# EAGLE design Decoder_35 (EAGLE 9.0.0)
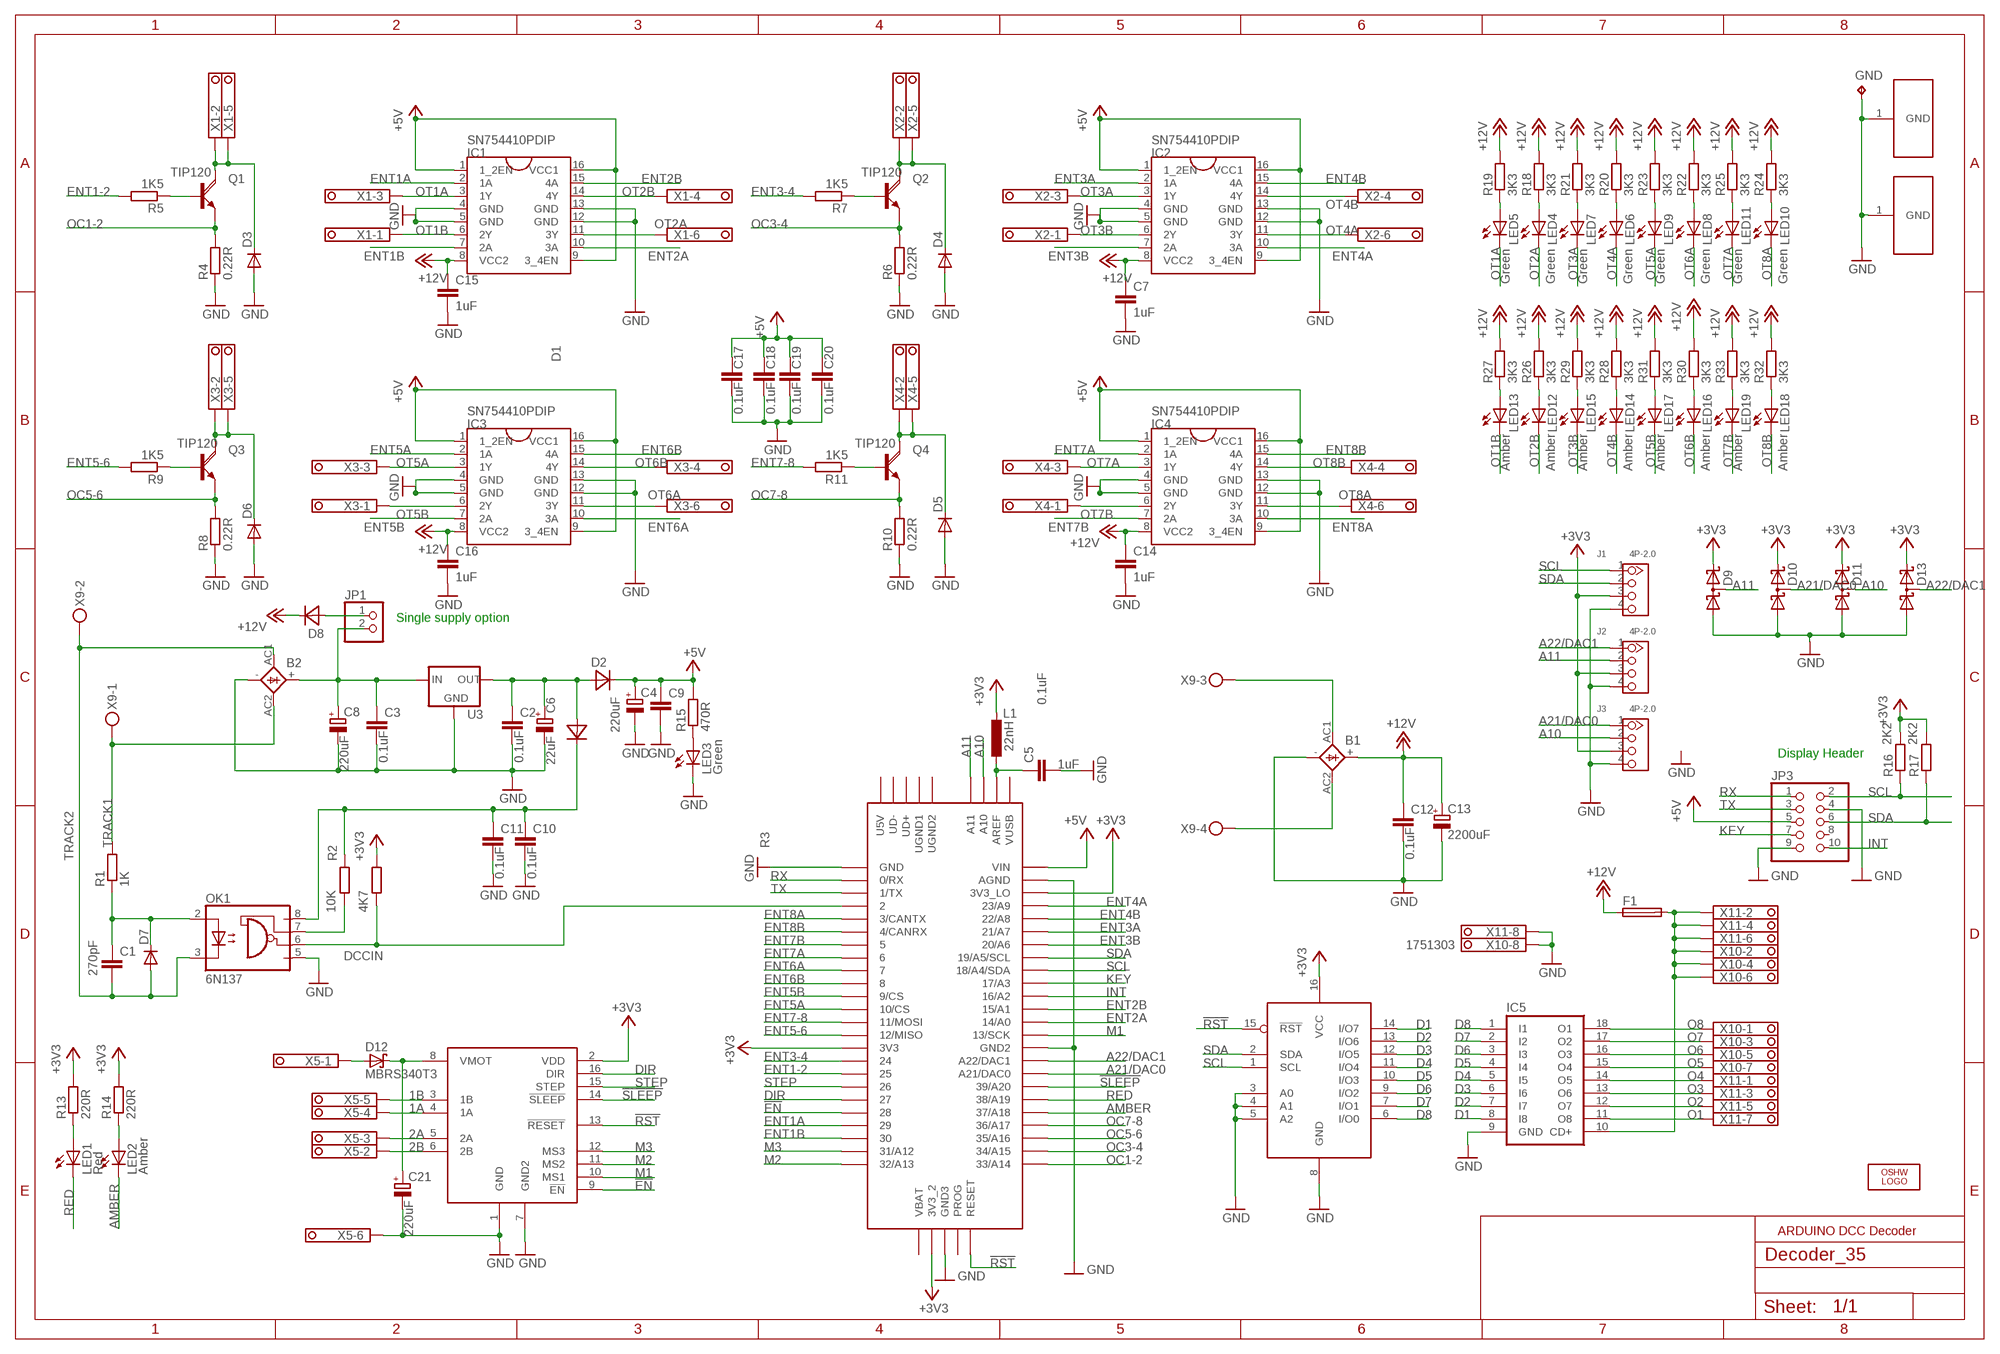
[diagram p0: schematic, sheet 1]

## Parts
B1  FB15A  [FB15A]
B2  FB15A  [FB15A]
C1  270pF  C-EUC0805  [C0805]
C2  0.1uF  C-EUC0805  [C0805]
C3  0.1uF  C-EUC0805  [C0805]
C4  220uF  CPOL-EUE2.5-5  [E2,5-5]
C5  1uF  C-EUC0805  [C0805]
C6  22uF  CPOL-EUE2.5-5  [E2,5-5]
C7  1uF  C-EUC0805  [C0805]
C8  220uF  CPOL-EUE5-8.5  [E5-8,5]
C9  0.1uF  C-EUC0805  [C0805]
C10  0.1uF  C-EUC0805  [C0805]
C11  0.1uF  C-EUC0805  [C0805]
C12  0.1uF  C-EUC0805  [C0805]
C13  2200uF  CPOL-EUE5-13  [E5-13]
C14  1uF  C-EUC0805  [C0805]
C15  1uF  C-EUC0805  [C0805]
C16  1uF  C-EUC0805  [C0805]
C17  0.1uF  C-EUC0805  [C0805]
C18  0.1uF  C-EUC0805  [C0805]
C19  0.1uF  C-EUC0805  [C0805]
C20  0.1uF  C-EUC0805  [C0805]
C21  220uF  CPOL-EUE5-8.5  [E5-8,5]
D1  MBRA340T3  [SMA]
D2  MBRA340T3  [SMA]
D3  CGRM4002-G  [SOD-123_MINI-SMA]
D4  CGRM4002-G  [SOD-123_MINI-SMA]
D5  CGRM4002-G  [SOD-123_MINI-SMA]
D6  CGRM4002-G  [SOD-123_MINI-SMA]
D7  CGRM4002-G  [SOD-123_MINI-SMA]
D8  MBRA340T3  [SMA]
D9  BAS70-04  [SOT23]
D10  BAS70-04  [SOT23]
D11  BAS70-04  [SOT23]
D12  MBRS340T3  [SMC]
D13  BAS70-04  [SOT23]
F1  SMD_FUSE  [1812]
GND  TPB2,54  [B2,54]
IC1  SN754410PDIP  [DIL16]
IC2  SN754410PDIP  [DIL16]
IC3  SN754410PDIP  [DIL16]
IC4  SN754410PDIP  [DIL16]
IC5  ULN2803A  [DIL18]
J1  4P-2.0  GROVE-CONNECTOR-DIP(4P-2.0)  [HW4-2.0]
J2  4P-2.0  GROVE-CONNECTOR-DIP(4P-2.0)  [HW4-2.0]
J3  4P-2.0  GROVE-CONNECTOR-DIP(4P-2.0)  [HW4-2.0]
JP1  PINHD-1X2  [1X02]
JP3  PINHD-2X5  [2X05]
L1  22nH  L-EUL2012C  [L2012C]
LED1  Red  LED3MM  [LED3MM]
LED2  Amber  LED3MM  [LED3MM]
LED3  Green  LED3MM  [LED3MM]
LED4  Green  LED3MM  [LED3MM]
LED5  Green  LED3MM  [LED3MM]
LED6  Green  LED3MM  [LED3MM]
LED7  Green  LED3MM  [LED3MM]
LED8  Green  LED3MM  [LED3MM]
LED9  Green  LED3MM  [LED3MM]
LED10  Green  LED3MM  [LED3MM]
LED11  Green  LED3MM  [LED3MM]
LED12  Amber  LED3MM  [LED3MM]
LED13  Amber  LED3MM  [LED3MM]
LED14  Amber  LED3MM  [LED3MM]
LED15  Amber  LED3MM  [LED3MM]
LED16  Amber  LED3MM  [LED3MM]
LED17  Amber  LED3MM  [LED3MM]
LED18  Amber  LED3MM  [LED3MM]
LED19  Amber  LED3MM  [LED3MM]
LOGO1  OSHW_LOGO_6MILX0200-NT  [OSHW_6X200_NOTEXT]
MT1  DINC45_MOUNT  [DIN_C45]
MT2  DINC45_MOUNT  [DIN_C45]
OK1  6N137  [DIL08]
Q1  TIP120  [TO220AH]
Q2  TIP120  [TO220AH]
Q3  TIP120  [TO220AH]
Q4  TIP120  [TO220AH]
R1  1K  R-EU_R0805  [R0805]
R2  10K  R-EU_R0805  [R0805]
R3  4K7  R-EU_R0805  [R0805]
R4  0.22R  R-EU_R2512  [R2512]
R5  1K5  R-EU_R0805  [R0805]
R6  0.22R  R-EU_R2512  [R2512]
R7  1K5  R-EU_R0805  [R0805]
R8  0.22R  R-EU_R2512  [R2512]
R9  1K5  R-EU_R0805  [R0805]
R10  0.22R  R-EU_R2512  [R2512]
R11  1K5  R-EU_R0805  [R0805]
R13  220R  R-EU_R0805  [R0805]
R14  220R  R-EU_R0805  [R0805]
R15  470R  R-EU_R0805  [R0805]
R16  2K2  R-EU_R0805  [R0805]
R17  2K2  R-EU_R0805  [R0805]
R18  3K3  R-EU_R0805  [R0805]
R19  3K3  R-EU_R0805  [R0805]
R20  3K3  R-EU_R0805  [R0805]
R21  3K3  R-EU_R0805  [R0805]
R22  3K3  R-EU_R0805  [R0805]
R23  3K3  R-EU_R0805  [R0805]
R24  3K3  R-EU_R0805  [R0805]
R25  3K3  R-EU_R0805  [R0805]
R26  3K3  R-EU_R0805  [R0805]
R27  3K3  R-EU_R0805  [R0805]
R28  3K3  R-EU_R0805  [R0805]
R29  3K3  R-EU_R0805  [R0805]
R30  3K3  R-EU_R0805  [R0805]
R31  3K3  R-EU_R0805  [R0805]
R32  3K3  R-EU_R0805  [R0805]
R33  3K3  R-EU_R0805  [R0805]
U1  A4988  [POLOLUA4988]
U2  PCA9557  [S016]
U3  V_REG_78XX-TO-220  [TO-220-ALT]
U$1  TEENSY_3.5/3.6  [TEENSY_3.5/3.6]
X1  1751280  [1751280]
X2  1751280  [1751280]
X3  1751280  [1751280]
X4  1751280  [1751280]
X5  1751280  [1751280]
X9  MKDSN1,5/4-5,08  [MKDSN1,5/4-5,08]
X10  1751303  [1751303]
X11  1751303  [1751303]

## Nets
1A: U1.4(1A) X5.4
1B: U1.3(1B) X5.5
2A: U1.5(2A) X5.3
2B: U1.6(2B) X5.2
!EN: U1.9(!EN) U$1.28
!RST: U1.13(!RESET) U2.15(!RST) U$1.RESET
!SLEEP: U1.14(!SLEEP) U$1.39/A20
+3V3 [pwr]: D9.2(C2) D10.2(C2) D11.2(C2) D13.2(C2) J1.3 J2.3 J3.3 L1.1 R3.2 R13.2 R14.2 R16.2 R17.2 U1.2(VDD) U2.16(VCC) U$1.3V3 U$1.3V3_2 U$1.3V3_LO
+5V: C4.+ C9.1 C17.1 C18.1 C19.1 C20.1 D2.C IC1.1(1_2EN) IC1.9(3_4EN) IC1.16(VCC1) IC2.1(1_2EN) IC2.9(3_4EN) IC2.16(VCC1) IC3.1(1_2EN) IC3.9(3_4EN) IC3.16(VCC1) IC4.1(1_2EN) IC4.9(3_4EN) IC4.16(VCC1) JP3.5 R15.2 U$1.VIN
+12V: B1.+ C7.1 C12.1 C13.+ C14.1 C15.1 C16.1 D8.C F1.1 IC1.8(VCC2) IC2.8(VCC2) IC3.8(VCC2) IC4.8(VCC2) R18.2 R19.2 R20.2 R21.2 R22.2 R23.2 R24.2 R25.2 R26.2 R27.2 R28.2 R29.2 R30.2 R31.2 R32.2 R33.2
A10: D11.3(C1A2) J3.2 U$1.A10
A11: D9.3(C1A2) J2.2 U$1.A11
A21/DAC0: D10.3(C1A2) J3.1 U$1.21/DAC0(A21/DAC0)
A22/DAC1: D13.3(C1A2) J2.1 U$1.A22/DAC1
AMBER: LED2.K(C) U$1.37/A18
D1: IC5.8(I8) U2.14(I/O7)
D2: IC5.7(I7) U2.13(I/O6)
D3: IC5.6(I6) U2.12(I/O5)
D4: IC5.5(I5) U2.11(I/O4)
D5: IC5.4(I4) U2.10(I/O3)
D6: IC5.3(I3) U2.9(I/O2)
D7: IC5.2(I2) U2.7(I/O1)
D8: IC5.1(I1) U2.6(I/O0)
DCCIN: OK1.6(VO) R3.1 U$1.2
DIR: U1.16(DIR) U$1.27
ENT1-2: R5.2 U$1.25
ENT1A: IC1.2(1A) U$1.29
ENT1B: IC1.7(2A) U$1.30
ENT2A: IC1.10(3A) U$1.14/A0
ENT2B: IC1.15(4A) U$1.15/A1
ENT3-4: R7.2 U$1.24
ENT3A: IC2.2(1A) U$1.21/A7
ENT3B: IC2.7(2A) U$1.20/A6
ENT4A: IC2.10(3A) U$1.23/A9
ENT4B: IC2.15(4A) U$1.22/A8
ENT5-6: R9.2 U$1.12/MISO
ENT5A: IC3.2(1A) U$1.10/CS
ENT5B: IC3.7(2A) U$1.9/CS
ENT6A: IC3.10(3A) U$1.7
ENT6B: IC3.15(4A) U$1.8
ENT7-8: R11.2 U$1.11/MOSI
ENT7A: IC4.2(1A) U$1.6
ENT7B: IC4.7(2A) U$1.5
ENT8A: IC4.10(3A) U$1.3/CANTX
ENT8B: IC4.15(4A) U$1.4/CANRX
GND: B1.- B2.- C2.2 C3.2 C4.- C5.2 C6.- C7.2 C8.- C9.2 C10.2 C11.2 C12.2 C13.- C14.2 C15.2 C16.2 C17.2 C18.2 C19.2 C20.2 C21.- D3.A D4.A D5.A D6.A D9.1(A1) D10.1(A1) D11.1(A1) D13.1(A1) GND.TP IC1.4(GND) IC1.5(GND) IC1.12(GND) IC1.13(GND) IC2.4(GND) IC2.5(GND) IC2.12(GND) IC2.13(GND) IC3.4(GND) IC3.5(GND) IC3.12(GND) IC3.13(GND) IC4.4(GND) IC4.5(GND) IC4.12(GND) IC4.13(GND) IC5.9(GND) J1.4 J2.4 J3.4 JP3.4 JP3.9 LED3.K(C) MT1.1(GND) MT2.1(GND) OK1.5(GND) R4.1 R6.1 R8.1 R10.1 U1.1(GND) U1.7(GND2) U2.3(A0) U2.4(A1) U2.5(A2) U2.8(GND) U3.GND U$1.AGND U$1.GND U$1.GND2 U$1.GND3 X5.6 X10.8 X11.8
INT: JP3.10 U$1.16/A2
KEY: JP3.7 U$1.17/A3
M1: U1.10(MS1) U$1.13/SCK
M2: U1.11(MS2) U$1.32/A13
M3: U1.12(MS3) U$1.31/A12
N$1: C5.1 L1.2 U$1.AREF
N$2: C1.1 D7.C OK1.2(A) R1.1
N$3 [pwr]: C10.1 C11.1 D1.C OK1.8(VCC) R2.2
N$4: OK1.7(VE) R2.1
N$5: Q2.B R7.1
N$6: C2.1 C6.+ D1.A D2.A U3.OUT
N$7: Q1.B R5.1
N$8: D3.C Q1.C X1.2 X1.5
N$9: LED5.A R19.1
N$12: D4.C Q2.C X2.2 X2.5
N$13: LED6.A R20.1
N$14: LED7.A R21.1
N$15: LED8.A R22.1
N$16: LED9.A R23.1
N$17: LED10.A R24.1
N$18: LED11.A R25.1
N$19: LED12.A R26.1
N$20: Q3.B R9.1
N$22: D6.C Q3.C X3.2 X3.5
N$23: LED13.A R27.1
N$24: LED14.A R28.1
N$25: LED15.A R29.1
N$26: LED16.A R30.1
N$27: Q4.B R11.1
N$29: D5.C Q4.C X4.2 X4.5
N$30: LED17.A R31.1
N$31: LED18.A R32.1
N$32: LED19.A R33.1
N$34: D8.A JP1.1
N$35: B1.AC1 X9.3
N$36: B1.AC2 X9.4
N$37: B2.+ C3.1 C8.+ JP1.2 U3.IN
N$38: F1.2 IC5.10(CD+) X10.2 X10.4 X10.6 X11.2 X11.4 X11.6
N$42: LED3.A R15.1
N$43: LED1.A R13.1
N$44: LED2.A R14.1
N$45: C21.+ D12.C U1.8(VMOT)
N$46: D12.A X5.1
N$47: LED4.A R18.1
O1: IC5.11(O8) X11.7
O2: IC5.12(O7) X11.5
O3: IC5.13(O6) X11.3
O4: IC5.14(O5) X11.1
O5: IC5.15(O4) X10.7
O6: IC5.16(O3) X10.5
O7: IC5.17(O2) X10.3
O8: IC5.18(O1) X10.1
OC1-2: Q1.E R4.2 U$1.33/A14
OC3-4: Q2.E R6.2 U$1.34/A15
OC5-6: Q3.E R8.2 U$1.35/A16
OC7-8: Q4.E R10.2 U$1.36/A17
OT1A: IC1.3(1Y) LED5.K(C) X1.3
OT1B: IC1.6(2Y) LED13.K(C) X1.1
OT2A: IC1.11(3Y) LED4.K(C) X1.6
OT2B: IC1.14(4Y) LED12.K(C) X1.4
OT3A: IC2.3(1Y) LED7.K(C) X2.3
OT3B: IC2.6(2Y) LED15.K(C) X2.1
OT4A: IC2.11(3Y) LED6.K(C) X2.6
OT4B: IC2.14(4Y) LED14.K(C) X2.4
OT5A: IC3.3(1Y) LED9.K(C) X3.3
OT5B: IC3.6(2Y) LED17.K(C) X3.1
OT6A: IC3.11(3Y) LED8.K(C) X3.6
OT6B: IC3.14(4Y) LED16.K(C) X3.4
OT7A: IC4.3(1Y) LED11.K(C) X4.3
OT7B: IC4.6(2Y) LED19.K(C) X4.1
OT8A: IC4.11(3Y) LED10.K(C) X4.6
OT8B: IC4.14(4Y) LED18.K(C) X4.4
RED: LED1.K(C) U$1.38/A19
RX: JP3.1 U$1.0/RX
SCL: J1.1 JP3.2 R16.1 U2.1(SCL) U$1.18/A4/SDA
SDA: J1.2 JP3.6 R17.1 U2.2(SDA) U$1.19/A5/SCL
STEP: U1.15(STEP) U$1.26
TRACK1: B2.AC2 R1.2 X9.1
TRACK2: B2.AC1 C1.2 D7.A OK1.3(C) X9.2
TX: JP3.3 U$1.1/TX
Unconnected: JP3.8 U$1.PROG U$1.U5V U$1.UD+ U$1.UD- U$1.UGND1 U$1.UGND2 U$1.VBAT U$1.VUSB

## Notes on the sheet
- Single supply option
- Display Header
- ARDUINO DCC Decoder

## Library data of the parts
B1 B2 = rectifier:FB15A: FAGOR RECTIFIER grid 3 x 5 mm
C1-C3 C5 C7 C9-C12 C14-C20 = rcl:C-EU: CAPACITOR, European symbol; SPICEPREFIX: C
C4 C6 C8 C13 C21 = rcl:CPOL-EU: POLARIZED CAPACITOR, European symbol; SPICEPREFIX: C
D1 D2 D8 = diode:MBRA340T3: Surface Mount Schottky Power Rectifier Source: http://www.onsemi.com/pub_link/Collateral/MBRA340T3-D.PDF
D3-D7 = diode:CGRM400*-G: Molded plasitc,JEDEC SOD-123/Mini SMA Source: Comchip CGRM4001-G.pdf
D9-D11 D13 = diode:BAS70-04: Silicon Schottky Diodes General-purpose diode for high-speed switching
D12 = diode:MBRS3*0T3: SCHOTTKY BARRIER RECTIFIER 3.0 AMPERES 20, 30, 40 VOLT Source: MBRS340T3-D.pdf
F1 = GJR:SMD_FUSE: SMD Resettable Fuse; FARNELL: 1597001; MANUFACTURER: Littelfuse; RATING: 500mA
GND = testpad:TP: Test pad
IC1-IC4 = AlexW-Eagle-Libraries:SN754410
IC5 = uln-udn:ULN2803A: DRIVER ARRAY
J1-J3 = Seeed-Connector:GROVE-CONNECTOR-DIP(4P-2.0): 320110033
JP1 = pinhead:PINHD-1X2: PIN HEADER
JP3 = pinhead:PINHD-2X5: PIN HEADER
L1 = rcl:L-EU: INDUCTOR, European symbol; SPICEPREFIX: L
LED1-LED19 = adafruit:LED: LED OSRAM: - CHIPLED LG R971, LG N971, LY N971, LG Q971, LY Q971, LO R971, LY R971 LH N974, LH R974 LS Q976, LO Q976, LY Q976 LO Q996 - Hyper CHIPLED LW Q18S LB Q993, LB Q99A, LB R99A - SideLED LS A670, LO A670, LY A670, LG A670, LP A670 LB A673, LV A673, LT A673, LW A673 LH A674 LY A675 LS A676, LA A676, LO A676, LY A676, LW A676 LS A679, LY A679, LG A679 - Hyper Micro SIDELED® LS Y876, LA Y876, LO Y876, LY Y876 LT Y87S - SmartLED LW L88C, LW L88S LB L89C, LB L89S, LG L890 LS L89K, LO L89K, LY L89K LS L896, LA L896, LO L896, LY L896 - TOPLED LS T670, LO T670, LY T670, LG T670, LP T670 LSG T670, LSP T670, LSY T670, LOP T670, LYG T670 LG T671, LOG T671, LSG T671 LB T673, LV T673, LT T673, LW T673 LH T674 LS T676, LA T676, LO T676, LY T676, LB T676, LH T676, LSB T676, LW T676 LB T67C, LV T67C, LT T67C, LS T67K, LO T67K, LY T67K, LW E67C LS E67B, LA E67B, LO E67B, LY E67B, LB E67C, LV E67C, LT E67C LW T67C LS T679, LY T679, LG T679 LS T770, LO T770, LY T770, LG T770, LP T770 LB T773, LV T773, LT T773, LW T773 LH T774 LS E675, LA E675, LY E675, LS T675 LS T776, LA T776, LO T776, LY T776, LB T776 LHGB T686 LT T68C, LB T68C - Hyper Mini TOPLED® LB M676 - Mini TOPLED Santana® LG M470 LS M47K, LO M47K, LY M47K Source: http://www.osram.convergy.de/
LOGO1 = ohw-logo:OSHW_LOGO_6MIL
MT1 MT2 = GJR:DINC45_MOUNT: DIN Rail C45 Mount
OK1 = optocoupler:6N137: MOTOROLA OPTO COUPLER; MPN: 6N137; OC_FARNELL: 1328376; OC_NEWARK: 52M1895
Q1-Q4 = transistor-power:TIP120: NPN DARLINGTON TRANSISTOR
R1-R11 R13-R33 = rcl:R-EU_: RESISTOR, European symbol; SPICEPREFIX: R
U1 = GJR:A4988: Pololu A4988 Stepper Module
U2 = GJR:PCA9557: 8 bit I2C I/O port with Reset
U3 = SparkFun-IC-Power:V_REG_78XX: Voltage Regulator Standard 78xx regulator. IGO (Input Ground Output). Spark Fun Electronics SKU : COM-00107; PROD_ID: VREG-08450; SF_ID: COM-00107
U$1 = Teensy356:TEENSY_3.5/3.6
X1-X5 = con-phoenix-350:1751280: MKDS 1/ 6-3,5 Printklemme Nennstrom: 10 A Bemessungsspannung: 160 V Raster: 3,5 mm Polzahl: 6 Montageart: Löten Anschlussart: Schraubanschluss Anschlussrichtung vom Leiter zur Platine: 0° Source: http://eshop.phoenixcontact.com .. 1751280.pdf; MPN: 1751280; OC_FARNELL: unknown; OC_NEWARK: 27R1765
X9 = con-phoenix-508:MKDSN1,5/4-5,08: MKDSN 1,5/ 4-5,08 Printklemme Nennstrom: 13,5 A Nennspannung: 250 V Rastermaß: 5,08 mm Polzahl: 4 Anschlussart: Schraubanschluss Montage: Löten Anschlussrichtung Leiter/Platine: 0 ° Artikelnummer: 1729144 Source: http://eshop.phoenixcontact.com .. 1729144.pdf
X10 X11 = con-phoenix-350:1751303: MKDS 1/ 8-3,5 Printklemme Nennstrom: 10 A Bemessungsspannung: 160 V Raster: 3,5 mm Polzahl: 8 Montageart: Löten Anschlussart: Schraubanschluss Anschlussrichtung vom Leiter zur Platine: 0° Source: http://eshop.phoenixcontact.com .. .pdf; OC_FARNELL: unknown; OC_NEWARK: unknown

## Net classes
0 default: clearance 0.205 mm
1 pwr: width 0.2 mm, drill 0.3 mm, clearance 0.205 mm to class 0, clearance 0.205 mm

## Board
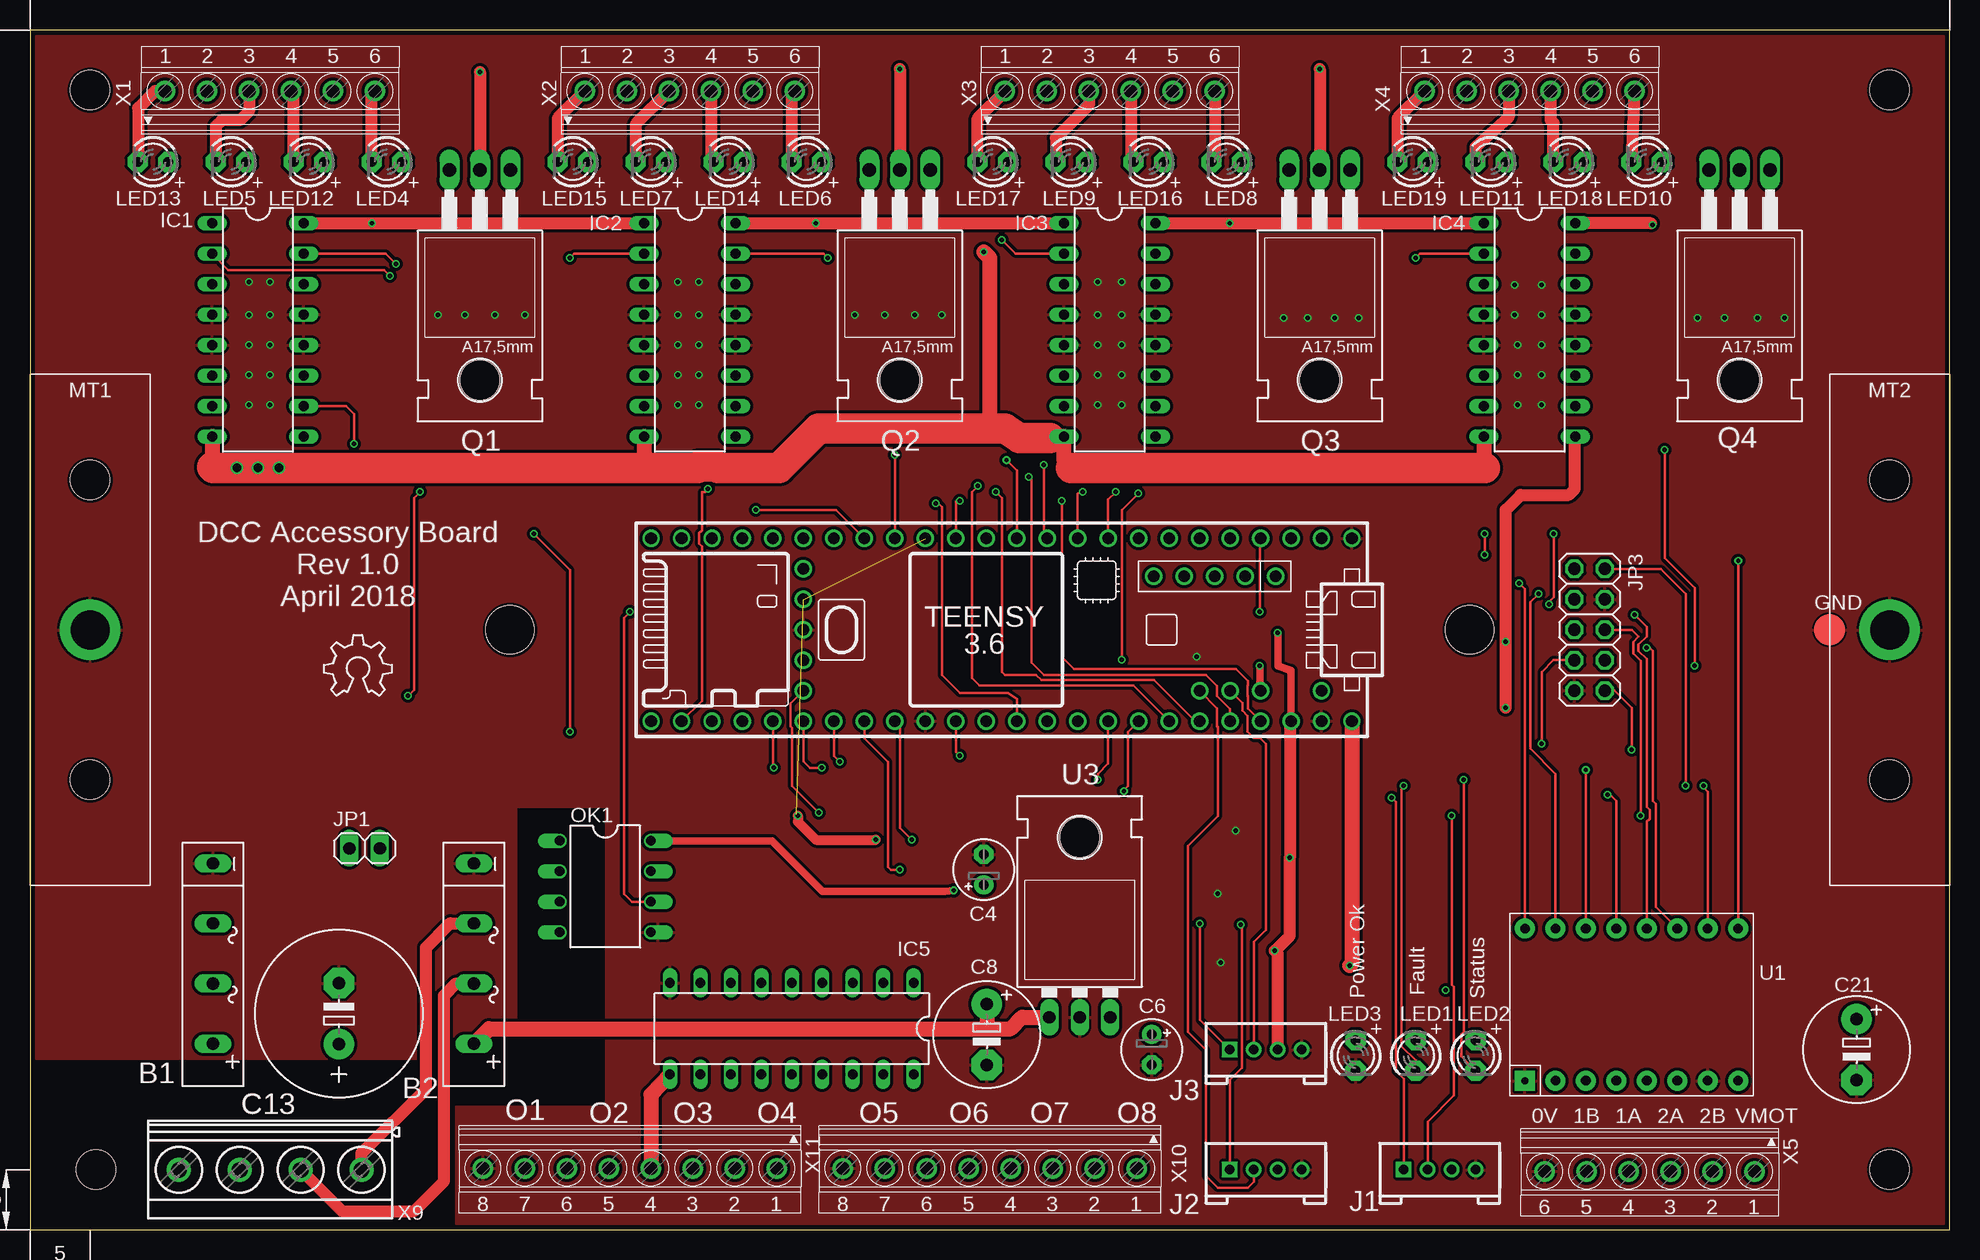
[diagram p1: board, top side]
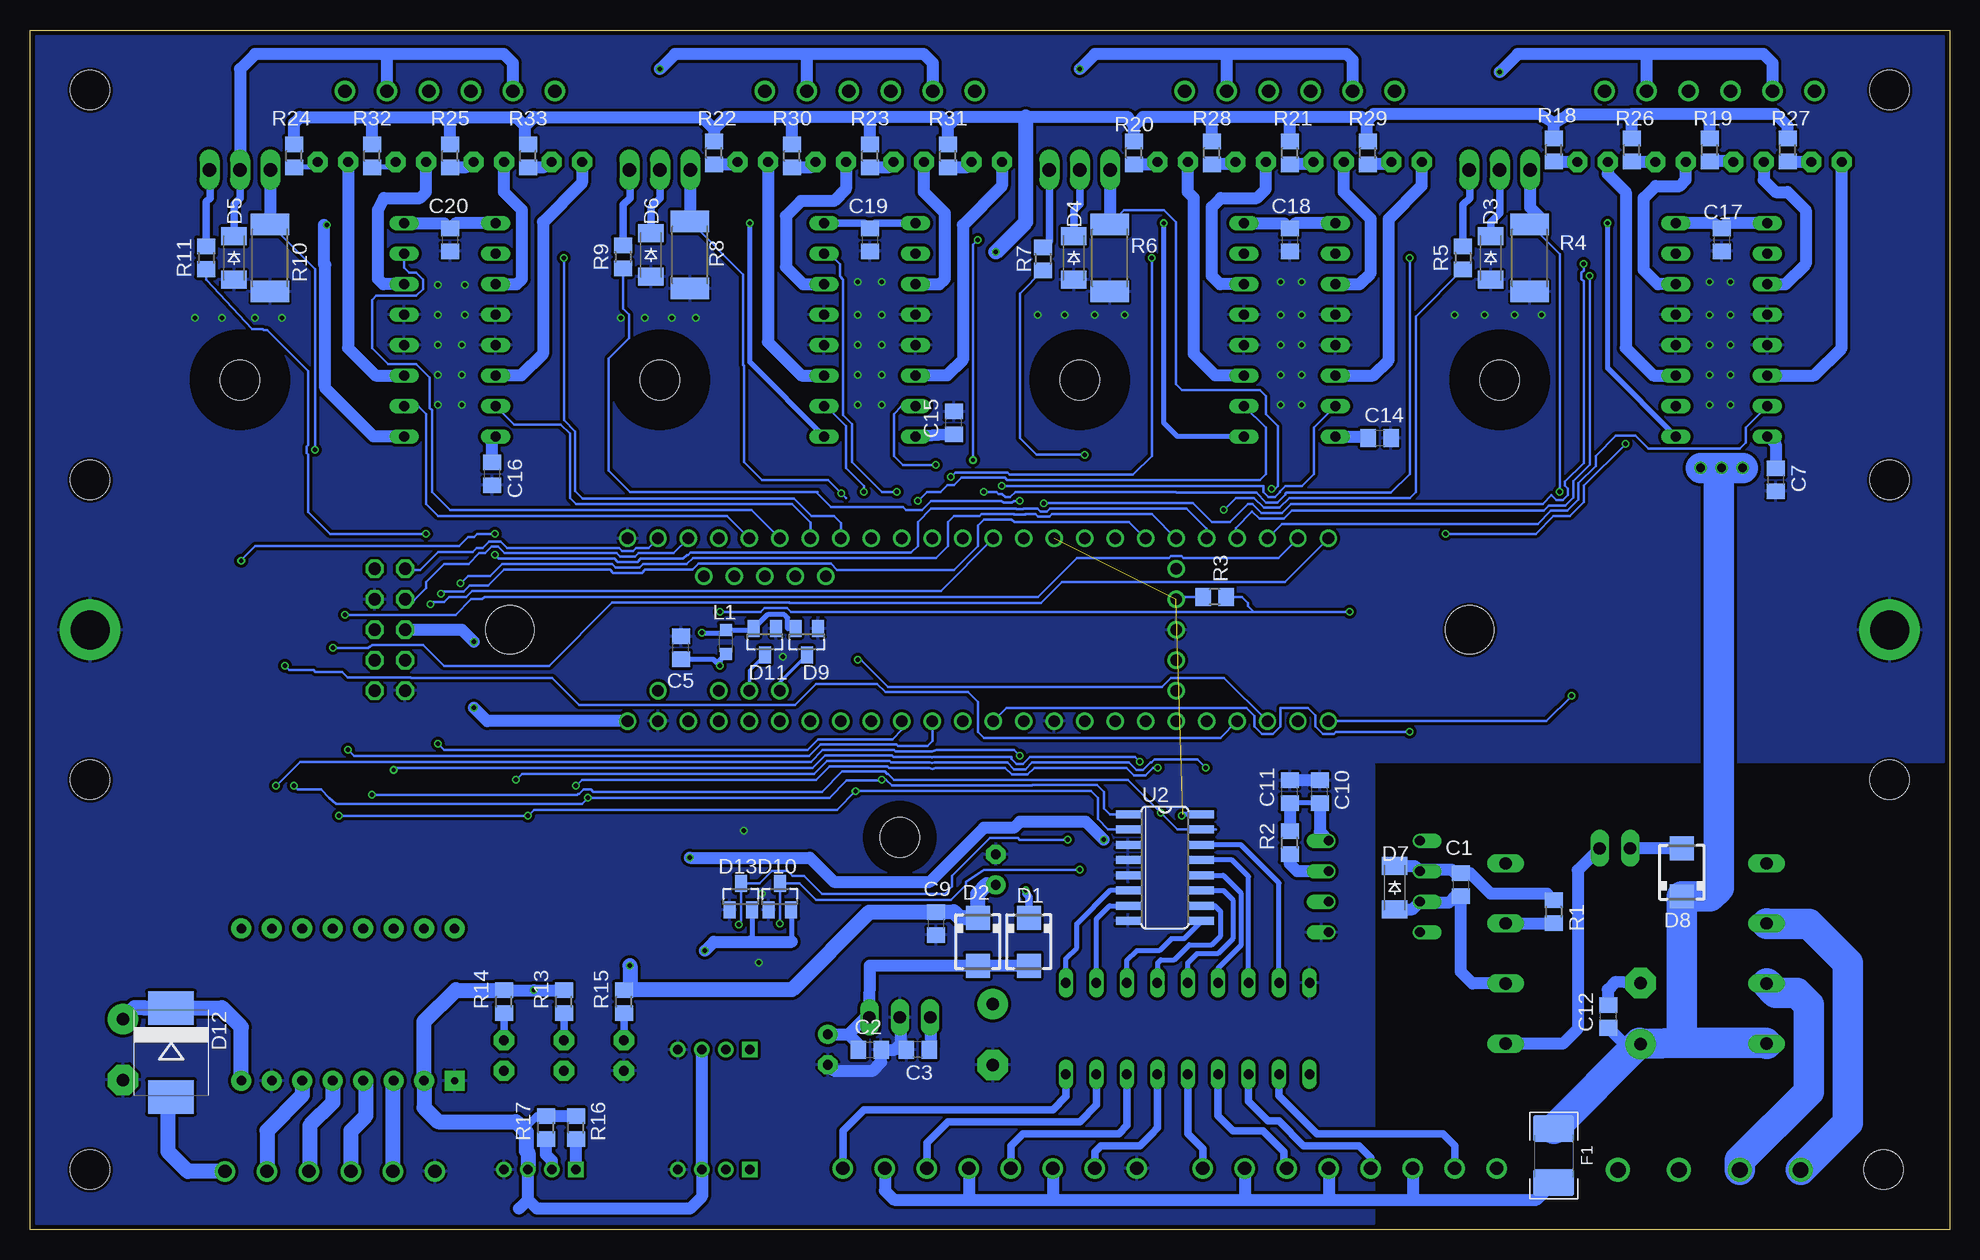
[diagram p2: board, bottom side, seen from below]

Size 160 x 100 mm. Coordinates in mm from the lower left corner, seen from the top.
Outline: 0,0 160,0 160,100 0,100 0,0
Copper layers (1*16): Top 0.07mm / dielectric 1.55mm / Bottom 0.07mm
Design rules "eC_2Layer_PClass4_BaseCopperO70": minimum track width 0.2mm, minimum drill 0.35mm, track to track 0.25mm, track to pad 0.25mm, pad to pad 0.25mm, via to via 0.25mm, smd to smd 0mil, copper to edge 0.25mm, drill to drill 0.35mm, minimum pad ring 0.2mm, minimum via ring 0.15mm, stop-mask expansion 0mil, vias tented up to drill 0.45mm, thermal gap 0.2mm
Holes 4 mm at 40,50 120,50
Holes 3.25 mm at 5,95 5.5,5 155,5 155,95

### Footprints (pad centres in the part's own frame; a part is rotated, then mirrored left to right if it is on the bottom)
FB15A = drill 1.016 long: + -7.5,0; - 7.511,0; AC1 -2.496,0; AC2 2.533,0
C0805 = smd 1.3 x 1.5: 1 -0.95,0; 2 0.95,0
E2,5-5 = drill 0.813 pad 1.6: + -1.27,0 | drill 0.813 pad 1.6 octagon: - 1.27,0
E5-8,5 = drill 1.016 pad 2.54: + -2.54,0 | drill 1.016 pad 2.54 octagon: - 2.54,0
E5-13 = drill 1.016 pad 2.54: + -2.54,0 | drill 1.016 pad 2.54 octagon: - 2.54,0
SMA = smd 2 x 2: A 2,0; C -2,0
SOD-123_MINI-SMA = smd 1.5 x 2.1: A 1.8,0; C -1.8,0
SOT23 = smd 1 x 1.4: 1 -0.95,-1.1; 2 0.95,-1.1; 3 0,1.1
SMC = smd 2.8 x 3.8: A 3.7,0; C -3.7,0
1812 = smd 2.25 x 3.4: 1 -2.25,0; 2 2.25,0
B2,54 = smd 2.54 x 2.54: TP 0,0
DIL16 = drill 0.813 long: 1 -8.89,-3.81; 2 -6.35,-3.81; 3 -3.81,-3.81; 4 -1.27,-3.81; 5 1.27,-3.81; 6 3.81,-3.81; 7 6.35,-3.81; 8 8.89,-3.81; 9 8.89,3.81; 10 6.35,3.81; 11 3.81,3.81; 12 1.27,3.81; 13 -1.27,3.81; 14 -3.81,3.81; 15 -6.35,3.81; 16 -8.89,3.81
DIL18 = drill 0.813 long: 1 -10.16,-3.81; 2 -7.62,-3.81; 3 -5.08,-3.81; 4 -2.54,-3.81; 5 0,-3.81; 6 2.54,-3.81; 7 5.08,-3.81; 8 7.62,-3.81; 9 10.16,-3.81; 10 10.16,3.81; 11 7.62,3.81; 12 5.08,3.81; 13 2.54,3.81; 14 0,3.81; 15 -2.54,3.81; 16 -5.08,3.81; 17 -7.62,3.81; 18 -10.16,3.81
HW4-2.0 = drill 0.8 pad 1.27 square: 1 -3,0 | drill 0.8 pad 1.27: 2 -1,0; 3 1,0; 4 3,0
1X02 = drill 1.016 long: 1 -1.27,0; 2 1.27,0
2X05 = drill 1.016 octagon: 1 -5.08,-1.27; 2 -5.08,1.27; 3 -2.54,-1.27; 4 -2.54,1.27; 5 0,-1.27; 6 0,1.27; 7 2.54,-1.27; 8 2.54,1.27; 9 5.08,-1.27; 10 5.08,1.27
L2012C = smd 1 x 1: 1 -1,0; 2 1,0
LED3MM = drill 0.813 pad 1.676 octagon: A -1.27,0; K 1.27,0
DIN_C45 = drill 3.25 pad 5.08: 1 0,0 | hole 3.25: 0,12.5; 0,-12.5
DIL08 = drill 0.813 offset: 1 -3.81,-3.81; 2 -1.27,-3.81; 3 1.27,-3.81; 4 3.81,-3.81; 5 3.81,3.81; 6 1.27,3.81; 7 -1.27,3.81; 8 -3.81,3.81
TO220AH = drill 1.118 long: B -2.54,-6.35; C 0,-6.35; E 2.54,-6.35 | hole 3.302: 0,11.176
R0805 = smd 1.3 x 1.5: 1 -0.95,0; 2 0.95,0
R2512 = smd 1.8 x 3.2: 1 -2.8,0; 2 2.8,0
POLOLUA4988 = drill 0.6 pad 1.676 square: 1 -6.35,8.89 | drill 0.8 pad 1.676: 2 -6.35,6.35; 3 -6.35,3.81; 4 -6.35,1.27; 5 -6.35,-1.27; 6 -6.35,-3.81; 7 -6.35,-6.35; 8 -6.35,-8.89; 9 6.35,-8.89; 10 6.35,-6.35; 11 6.35,-3.81; 12 6.35,-1.27; 13 6.35,1.27; 14 6.35,3.81; 15 6.35,6.35; 16 6.35,8.89
S016 = smd 0.66 x 2.032: 1 -4.445,-3.073; 2 -3.175,-3.073; 3 -1.905,-3.073; 4 -0.635,-3.073; 5 0.635,-3.073; 6 1.905,-3.073; 7 3.175,-3.073; 8 4.445,-3.073; 9 4.445,3.073; 10 3.175,3.073; 11 1.905,3.073; 12 0.635,3.073; 13 -0.635,3.073; 14 -1.905,3.073; 15 -3.175,3.073; 16 -4.445,3.073
TO-220-ALT = drill 1.016 long: GND 0,-3.81; IN -2.54,-3.81; OUT 2.54,-3.81 | hole 3.302: 0,11.176
TEENSY_3.5/3.6 = drill 0.965: 0/RX -25.4,-7.62; 1/TX -22.86,-7.62; 2 -20.32,-7.62; 3/CANTX -17.78,-7.62; 3V3 7.62,-7.62; 3V3_2 17.78,-2.54; 3V3_LO -22.86,7.62; 4/CANRX -15.24,-7.62; 5 -12.7,-7.62; 6 -10.16,-7.62; 7 -7.62,-7.62; 8 -5.08,-7.62; 9/CS -2.54,-7.62; 10/CS 0,-7.62; 11/MOSI 2.54,-7.62; 12/MISO 5.08,-7.62; 13/SCK 5.08,7.62; 14/A0 2.54,7.62; 15/A1 0,7.62; 16/A2 -2.54,7.62; 17/A3 -5.08,7.62; 18/A4/SDA -7.62,7.62; 19/A5/SCL -10.16,7.62; 20/A6 -12.7,7.62; 21/A7 -15.24,7.62; 21/DAC0 12.7,7.62; 22/A8 -17.78,7.62; 23/A9 -20.32,7.62; 24 10.16,-7.62; 25 12.7,-7.62; 26 15.24,-7.62; 27 17.78,-7.62; 28 20.32,-7.62; 29 22.86,-7.62; 30 25.4,-7.62; 31/A12 27.94,-7.62; 32/A13 30.48,-7.62; 33/A14 30.48,7.62; 34/A15 27.94,7.62; 35/A16 25.4,7.62; 36/A17 22.86,7.62; 37/A18 20.32,7.62; 38/A19 17.78,7.62; 39/A20 15.24,7.62; A10 -17.78,5.08; A11 -15.24,5.08; A22/DAC1 10.16,7.62; AGND -25.4,7.62; AREF -20.32,5.08; GND -27.94,-7.62; GND2 7.62,7.62; GND3 17.78,0; PROG 17.78,2.54; RESET 17.78,5.08; U5V -21.59,-4.445; UD+ -16.51,-4.445; UD- -19.05,-4.445; UGND1 -13.97,-4.445; UGND2 -11.43,-4.445; VBAT 17.78,-5.08; VIN -27.94,7.62; VUSB -25.4,5.08
1751280 = drill 1.1 pad 1.7: 1 -8.75,-0.1; 2 -5.25,-0.1; 3 -1.75,-0.1; 4 1.75,-0.1; 5 5.25,-0.1; 6 8.75,-0.1
MKDSN1,5/4-5,08 = drill 1.3 pad 2: 1 -7.641,0.025; 2 -2.561,0.025; 3 2.519,0.025; 4 7.599,0.025
1751303 = drill 1.1 pad 1.7: 1 -12.25,-0.1; 2 -8.75,-0.1; 3 -5.25,-0.1; 4 -1.75,-0.1; 5 1.75,-0.1; 6 5.25,-0.1; 7 8.75,-0.1; 8 12.25,-0.1

### Placement (x,y rotation side)
B1  15.25,23 90 top
B2  37,23 90 top
C1  40.75,28.75 270 bottom
C2  90,15 0 bottom
C3  86,15 180 bottom
C4  79.5,30 90 top
C5  105.75,48.5 90 bottom
C6  93.5,15 270 top
C7  14.5,62.5 270 bottom
C8  79.75,16.25 270 top
C9  84.5,25.5 270 bottom
C10  52.5,36.5 90 bottom
C11  55,36.5 90 bottom
C12  28.43,17.76 90 bottom
C13  25.75,18 90 top
C14  47.5,66 0 bottom
C15  83,67.25 90 bottom
C16  121.5,63 270 bottom
C17  19,82.5 270 bottom
C18  55,82.5 270 bottom
C19  90,82.5 270 bottom
C20  125,82.5 270 bottom
C21  152.25,15 270 top
D1  76.75,24 270 bottom
D2  81,24 270 bottom
D3  38.25,81 270 bottom
D4  73,81 270 bottom
D5  143,81 270 bottom
D6  108.25,81.25 270 bottom
D7  46.25,28.5 270 bottom
D8  22.31,29.79 90 bottom
D9  95.25,49 180 bottom
D10  97.5,27.75 0 bottom
D11  98.75,49 180 bottom
D12  148.25,14.75 270 bottom
D13  100.75,27.75 0 bottom
F1  33,6.16 270 bottom
GND  150,50 0 top
IC1  19,75 270 top
IC2  55,75 270 top
IC3  90,75 270 top
IC4  125,75 270 top
IC5  63.5,16.75 180 top
J1  117.5,5 0 top
J2  103,5 0 top
J3  103,15 0 top
JP1  27.89,31.78 0 top
JP3  130,50 270 top
L1  102,49 270 bottom
LED1  115.5,14.5 270 top
LED2  120.5,14.5 270 top
LED3  110.5,14.5 270 top
LED4  29.75,89 180 top
LED5  16.75,89 180 top
LED6  64.75,89 180 top
LED7  51.75,89 180 top
LED8  99.75,89 180 top
LED9  86.75,89 180 top
LED10  134.75,89 180 top
LED11  121.75,89 180 top
LED12  23.25,89 180 top
LED13  10.25,89 180 top
LED14  58.25,89 180 top
LED15  45.25,89 180 top
LED16  93.25,89 180 top
LED17  80.25,89 180 top
LED18  128.25,89 180 top
LED19  115.25,89 180 top
LOGO1  24.5,44.5 0 top
MT1  5,50 0 top
MT2  155,50 0 top
OK1  47.95,28.6 270 top
Q1  37.5,82 180 top
Q2  72.5,82 180 top
Q3  107.5,82 180 top
Q4  142.5,82 180 top
R1  33,26.5 270 bottom
R2  55,32.25 90 bottom
R3  61.25,52.75 180 bottom
R4  35,81 90 bottom
R5  40.57,81 270 bottom
R6  70,81 90 bottom
R7  75.57,80.92 270 bottom
R8  105,81.25 90 bottom
R9  110.57,81.09 270 bottom
R10  140,81 90 bottom
R11  145.32,81.01 270 bottom
R13  115.5,19 90 bottom
R14  120.5,19 90 bottom
R15  110.5,19 90 bottom
R16  114.5,8.5 90 bottom
R17  117,8.5 90 bottom
R18  33,90 90 bottom
R19  20,90 90 bottom
R20  68,89.75 90 bottom
R21  55,89.75 90 bottom
R22  103,89.75 90 bottom
R23  90,89.5 90 bottom
R24  138,89.5 90 bottom
R25  125,89.5 90 bottom
R26  26.5,90 90 bottom
R27  13.5,90 90 bottom
R28  61.5,89.75 90 bottom
R29  48.5,89.75 90 bottom
R30  96.5,89.5 90 bottom
R31  83.5,89.5 90 bottom
R32  131.5,89.5 90 bottom
R33  118.5,89.5 90 bottom
U1  133.5,18.75 90 top
U2  65.4,30.17 270 bottom
U3  87.5,21.5 0 top
U$1  82.25,50 180 top
X1  20,95 0 top
X2  55,95 0 top
X3  90,95 0 top
X4  125,95 0 top
X5  135,4.75 180 top
X9  20,5 180 top
X10  80,5 180 top
X11  50,5 180 top

### Tracks (layer width: path | path; a pad name or v marks a point on that pad's centre or on a via)
1A
  Bottom 1.27: X5.4 133.25,8.25 132,9.5 132,12.17 U1.4
1B
  Bottom 1.27: X5.5 129.75,12.34 U1.3
2A
  Bottom 1.27: U1.5 134.77,10.58 136.68,8.68 136.68,4.92 X5.3
2B
  Bottom 1.27: U1.6 137.31,11.19 140.25,8.25 X5.2
!EN  (via drill 0.35)
  Top 0.2: U1.9 v142.39,55.75 | v121.25,56.25 v121.25,58
  Bottom 0.2: U$1.28 61.93,58.43 63.6,60.1 75,60.1 75.22,59.88 75.78,59.88 76,60.1 77.19,60.1 77.22,60.08 77.78,60.08 77.81,60.1 84.9,60.1 86,59 86,57 86.55,56.45 104.94,56.45 105.14,56.25 105.25,56.25 105.57,55.93 109.09,55.93 109.37,55.65 111.01,55.65 111.29,55.93 120.93,55.93 v121.25,56.25 | v142.39,55.75 142.5,55.75 141.25,57 124.25,57 123.5,57.75 123,57.75 122.75,58 v121.25,58
!RST  (via drill 0.35)
  Top 0.2: U1.13 132.23,35.75 131.73,36.25 v131.5,36.25 | U$1.RESET 63.4,43.85 63.4,41.94 63.5,41.83 63.5,37 v65.75,34.75
  Bottom 0.2: 61.16,33.34 U2.15 64.34,33.34 v65.75,34.75 68.5,37.5 76.64,37.5 76.66,37.48 87.97,37.48 88.5,38 88.55,38 88.72,38.17 92.33,38.17 94,36.5 113.05,36.5 113.22,36.67 113.87,36.67 114.22,36.33 114.31,36.33 114.39,36.25 v131.5,36.25
!SLEEP  (via drill 0.35)
  Top 0.2: U1.14 v129.69,38.31 | v67.5,39 67,39.5 U$1.39/A20
  Bottom 0.2: v129.69,38.31 129.5,38.5 94.77,38.5 93.75,39.52 88.16,39.52 88.04,39.4 84.89,39.4 84.8,39.36 84.71,39.4 78.17,39.4 78.17,39.22 77.78,38.83 77.22,38.83 76.64,39.4 67.9,39.4 v67.5,39
+3V3  (via drill 0.35)  (2 unrouted)
  Top 0.61: 105,42.27 U$1.3V3_LO 105.11,46.61 104,47 v104,49.75
  Top 0.813: v64,34.5 64,34 65.5,32.5 v70.5,32.5
  Top 1.016: J3.3 104,23 v103.75,23.25 105,24.5 v105,31 105,42.27
  Bottom 0.2: R3.2 64.26,52.75 U$1.3V3_2
  Bottom 0.406: 96.5,24 96.5,26.6 D10.2 96.5,26.7 | D13.2 99.8,24.2 100,24 | U2.16 63.88,34.62 v64,34.5 | D9.2 96.85,50.1 96.85,50.99 97.11,51.25 98.49,51.25 98.55,51.25 D11.2 99.8,50 L1.1 102.25,49.75 v104,49.75
  Bottom 0.61: J1.3 118.5,8.75 117.75,9.5 117.7,9.45 R17.2
  Bottom 1.016: J3.3 J2.3 104,2.75 105,1.75 117.75,1.75 118.5,2.5 | 118.5,2.5 J1.3 | R14.2 v118,19.95 R13.2 | R16.2 R17.2 | 119.25,1.75 118.5,2.5 | v103.75,23.25 103,24 100,24 96.5,24 | v105,31 95,31 93,29 85,29 80.5,33.5 78,33.5 77.5,34 72,34 v70.5,32.5
  Bottom 1.27: J1.3 118.5,6.4 118.64,6.53 118.64,8.13 119.5,9 126,9 127.15,10.15 U1.2 127.15,17.35 124.5,20 124.45,19.95 R14.2
+5V  (via drill 0.35)
  Top 0.406: v135.25,83.75 135.11,83.89
  Top 1.016: IC1.16 v28.5,83.89 IC2.1 | IC2.16 v65.5,83.89 IC3.1 | IC3.16 v100,83.89 IC4.1 | 135.11,83.89 IC4.16 | v123,43.5 v123,49 123,60 124.25,61.25 128.25,61.25 128.75,61.75 128.75,66.05 IC4.9
  Top 1.27: U$1.VIN 110.19,22.19 v110,22
  Bottom 0.406: IC2.9 64.36,66.11 65.5,67.25 v65.5,83.89 | IC1.9 28.5,71.8 v28.5,83.89 28.5,84 | IC3.9 100,72.3 v100,83.89 100,84 | 135.5,83.75 v135.25,83.75
  Bottom 0.61: 54.56,83.89 C18.1 55.44,83.89 | IC3.1 89.56,83.89 C19.1 90.44,83.89 IC3.16 | 124.56,83.89 C20.1 125.44,83.89
  Bottom 1.016: IC1.1 18.56,83.89 C17.1 19.69,83.89 IC1.16 | IC2.1 54.56,83.89 | IC2.16 55.44,83.89 | IC4.1 124.56,83.89 | IC4.16 125.44,83.89 | IC4.9 131.36,66.11 135.39,70.14 135.39,80.41 135.5,80.51 135.5,83.75 | U$1.VIN 121.88,42.38 v123,43.5 | v123,49 124,50 JP3.5
  Bottom 1.27: C4.+ 80.27,28.73 81,28 D2.C 82.5,26 83,26.5 C9.1 90.05,26.45 96.5,20 110,20 | 110,20 110.45,20 R15.2 | v110,22 110,20
+12V  (via drill 0.35, 0.7)
  Top 1.27: IC1.8 15.19,63.56 | IC2.8 51.19,63.69 51,63.5 | 86.75,63.5 86.19,64.06 IC3.8 85.11,66.11 85,66 | IC4.8 121.19,63.56 121.25,63.5 | 80,66.79 80,81 v79.5,81.5
  Top 2.54: 15.19,63.56 15.25,63.5 v19,63.5 51,63.5 55.64,63.5 55.74,63.59 57.26,63.59 57.36,63.5 62.44,63.5 65.72,66.79 80,66.79 81.28,66.79 82.49,66 85,66 | 121.25,63.5 86.75,63.5
  Bottom 1.016: R27.2 13.5,92 14.5,93 20,93 | 20,93 26.5,93 | 26.5,93 31.75,93 33,92.25 | R19.2 20,93 | R26.2 26.5,93 | R18.2 33,92.25 | 131.5,92.75 137.5,92.75 138,92.25 R24.2 | 131.5,92.75 125,92.75 | 125,92.75 119.5,92.75 118.75,92 | 83.5,92 84,92.75 90.25,92.75 | 90.25,92.75 96.25,92.75 | 96.25,92.75 102,92.75 103,91.75 | 90.25,92.75 90,92.25 R23.2 | 48.5,92.25 48.62,92.38 | 48.62,92.38 49,92.75 55,92.75 | 68,92 67.25,92.75 61.5,92.75 | 55,92.75 61.5,92.75 | 33,92.25 34.25,93 48,93 48.62,92.38 | 68,92 68.5,92.75 77,92.75 82.75,92.75 83.5,92 | 118.75,92 118,92.75 104,92.75 103,91.75 | C12.1 27.18,15.56 25.85,15.56 | IC1.8 15.06,66.11 14.5,65.5 C7.1 | IC2.8 48.56,66.11 C14.1 | C15.1 86.06,66.11 IC3.8 | IC4.8 121.56,66.11 C16.1 | 48.62,92.38 48.62,90.83 R29.2 | R21.2 55,92.75 | R28.2 61.5,92.75 | R20.2 68,92 | R31.2 83.5,92 | R30.2 96.5,92.5 96.25,92.75 | 103,91.75 R22.2 | R33.2 118.75,90.7 118.75,92 | R25.2 125,92.75 | R32.2 131.5,92.75
  Bottom 1.27: v79.5,81.5 77,84 77,92.75
  Bottom 2.54: 22,15.56 C13.+ 25.85,15.56 F1.1 | 22,15.56 15.31,15.56 B1.+ | 22,15.56 22.31,15.87 D8.C 19.96,27.79 19.25,28.5 19.25,63.5 v19,63.5 | v17.25,63.5 v19,63.5 | v20.75,63.5 v19,63.5
A10
  Top 0.2: J3.2 102,24 103,25 103,40.5 102.5,41 102,41 101.5,41.5 101.5,42.82 101.05,43.26 101.05,43.9 U$1.A10
  Bottom 0.305: D11.3 100.03,46.62 U$1.A10
A11
  Top 0.2: U$1.A11 98.96,43.45 98.96,41.94 99,41.89 99,34.5 96.5,32 96.5,16.5 98,15 98,4.5 99,3.5 101.5,3.5 102,4 J2.2
  Bottom 0.305: D9.3 97.49,45.66 U$1.A11
A21/DAC0  (via drill 0.35)
  Top 0.2: J3.1 97.5,17.5 v97.5,25.5 | v72.5,30 71.75,30 71.5,30.25 71.5,39 69.55,40.95 U$1.21/DAC0
  Bottom 0.2: v97.5,25.5 D10.3 95.85,28.85 94.5,27.5 83.25,27.5 82,28.75 82,29 80.5,30 v72.5,30
A22/DAC1  (via drill 0.35)
  Top 0.2: J2.1 100,12.5 101,13.5 101,25.5 v100.92,25.42 | v73.5,32.5 72.5,33.5 72.5,41.97 U$1.A22/DAC1
  Bottom 0.2: v100.92,25.42 101,25.5 100.75,25.75 D13.3 99.19,28.85 98.14,29.9 96.86,29.9 96.45,29.5 95.5,29.5 94,28 83.75,28 83.14,28.61 83.14,29.5 79.99,32.64 77.64,32.64 77.5,32.5 v73.5,32.5
AMBER  (via drill 0.35)
  Top 0.2: v119.5,37.5 119.5,16.45 119.31,16.26 119.31,14.42 LED2.K | v62,38.5 61.93,38.57 U$1.37/A18
  Bottom 0.2: v119.5,37.5 119,38 94.64,38 93.56,39.08 88.35,39.08 88.22,38.95 84.98,38.95 84.79,38.88 84.62,38.95 78.54,38.95 77.97,38.38 77.03,38.38 76.46,38.95 68.41,38.95 67.78,38.33 67.22,38.33 66.59,38.95 66.5,38.95 66.28,39.17 62.67,39.17 v62,38.5
D1
  Bottom 0.406: U2.14 59.08,32.08 56.25,29.25 56.03,29.03 55.88,28.88 IC5.8
D2
  Bottom 0.406: U2.13 59.8,30.8 58.42,29.42 IC5.7
D3
  Bottom 0.406: U2.12 60.53,29.54 59.08,28.08 59.08,23.67 60.96,21.79 IC5.6
D4
  Bottom 0.406: U2.11 60.52,28.27 59.75,27.5 59.75,24.25 61,23 62.75,23 63.5,22.25 IC5.5
D5
  Bottom 0.406: U2.10 61.26,27 61.25,27 60.75,26.5 60.75,24.5 61.5,23.75 63.37,23.75 64.61,22.5 65.75,22.5 66,22.25 66,20.6 IC5.4
D6
  Bottom 0.406: U2.9 63.8,24.25 64.86,24.25 65.86,23.25 67.75,23.25 68.6,22.4 68.6,20.57 IC5.3
D7
  Bottom 0.406: U2.7 70,27 71.12,25.88 IC5.2
D8
  Bottom 0.406: U2.6 69.98,28.27 72.75,25.5 72.75,23.5 73.66,22.59 IC5.1
DCCIN  (via drill 0.35)
  Top 0.2: OK1.6 50.17,27.33 49.5,28 49.5,51 v50,51.5 | v102.5,51.5 102.5,57.55 U$1.2
  Bottom 0.2: v50,51.5 58,51.5 | 58,51.5 63.99,51.5 64.03,51.47 96.54,51.47 96.88,51.81 98.78,51.81 99.12,51.47 100.97,51.47 v102.5,51.5 | R3.1 59,52.75 58.5,52.25 58.5,52 58,51.5
DIR  (via drill 0.35)
  Top 0.2: U1.16 124.61,53.39 v124.12,53.88
  Bottom 0.2: U$1.27 66.5,59.65 74.81,59.65 75.03,59.42 75.97,59.42 76.19,59.65 77.01,59.65 77.03,59.62 77.97,59.62 77.99,59.65 80.69,59.65 80.84,59.5 83,59.5 83.5,59 83.5,57 84.5,56 104.75,56 105.27,55.48 108.91,55.48 109.19,55.2 111.19,55.2 111.47,55.48 120.66,55.48 121.64,54.5 123.5,54.5 v124.12,53.88
ENT1-2  (via drill 0.35)
  Top 0.2: U$1.25 67.17,60 v60.5,60
  Bottom 0.2: R5.2 44.5,76.12 44.5,61.5 45,61 55.02,61 55.85,60.17 57.15,60.17 57.98,61 59.5,61 v60.5,60
ENT1A  (via drill 0.35)
  Top 0.2: IC1.2 16.54,80 29.5,80 v30,79.5
  Bottom 0.2: U$1.29 59.39,57.39 59.5,58.5 58.12,59.88 57.52,59.27 55.48,59.27 54.8,59.95 33.82,59.95 33.4,60.38 32.03,60.38 31.38,61.03 31.38,62.4 30,63.77 v30,79.5
ENT1B
  Bottom 0.2: IC1.7 17,66.84 17,65.62 17.5,65.12 25.12,65.12 26.18,66.17 27.82,66.17 29.5,64.5 29.5,63.64 30.93,62.21 30.93,60.85 31.85,59.92 33.21,59.92 34.31,58.83 55.65,58.83 U$1.30
ENT2A  (via drill 0.35)
  Top 0.2: IC1.10 26.35,68.65 27,68 v27,65.5 | v45,41.5 45,55 v42,58
  Bottom 0.2: v42,58 34.5,58 33.02,59.48 31.66,59.48 30.48,60.66 30.48,62.02 v27,65.5 | U$1.14/A0 78.59,43.5 58.61,43.5 57.92,42.82 57.92,41.94 57.3,41.31 56.41,41.31 55.78,41.94 55.78,43.5 53.5,43.5 52.84,42.84 52.84,41.94 52.22,41.31 51.33,41.31 51.13,41.5 v45,41.5
ENT2B  (via drill 0.35)
  Top 0.2: IC1.15 29.65,81.35 v30.5,80.5 | U$1.15/A1 82.25,44.25 81.5,44.75 77.5,44.75 76,46.25 76,60.25 75.7,60.55 v75.5,60.55
  Bottom 0.2: v30.5,80.5 30.5,79.95 30.68,79.78 30.68,79.22 30.5,79.05 30.5,63.91 32.05,62.36 32.05,62.01 31.82,61.78 31.82,61.22 32.22,60.83 32.78,60.83 33.18,61.23 33.91,60.5 54.89,60.5 55.66,59.73 57.34,59.73 58.11,60.5 58.5,60.5 60,59 61.5,59 63.05,60.55 v75.5,60.55
ENT3-4  (via drill 0.35)
  Top 0.2: U$1.24 v72.09,64.59
  Bottom 0.2: v72.09,64.59 76.09,64.59 77.5,66 77.5,78.04 R7.2
ENT3A  (via drill 0.35)
  Top 0.2: IC2.2 45.35,81.35 v45,81 | U$1.21/A7 97.12,42.38 93.7,45.8 84.31,45.8 83.86,46.25 81.25,46.25 81,46.5 81,61 v80.5,61.5
  Bottom 0.2: v45,81 45,63 46.55,61.45 55.28,61.45 55.38,61.35 55.38,61.28 56.03,60.62 56.97,60.62 57.79,61.45 64.45,61.45 64.5,61.5 77.86,61.5 78.31,61.05 78.69,61.05 78.96,61.33 79.28,61.33 79.45,61.5 v80.5,61.5
ENT3B  (via drill 0.35)
  Top 0.2: U$1.20/A6 91.98,45.35 79.15,45.35 78.5,46 78.5,61.5 v79,62
  Bottom 0.2: IC2.7 53,66.84 53,63 54,62 55.36,62 55.83,61.54 55.83,61.47 56.22,61.08 56.78,61.08 57.17,61.47 57.17,61.97 57.2,62 v79,62
ENT4A  (via drill 0.35)
  Top 0.2: U$1.23/A9 101.5,43.45 101.5,44.47 101.5,44.48 101.5,45.37 101.5,45.75 100.5,46.75 87,46.75 86,47.75 v86,60.75
  Bottom 0.2: IC2.10 57,66.84 57,63 57.5,62.5 78.55,62.5 78.72,62.67 82.37,62.67 82.97,62.08 83.53,62.08 84.11,61.5 85.25,61.5 v86,60.75
ENT4B  (via drill 0.35)
  Top 0.2: IC2.15 66.15,81.35 v66.5,81 | U$1.22/A8 100.03,43.4 98.96,44.48 98.96,45.29 98,46.25 84.5,46.25 83.47,47.27 83.47,62.52 v83.25,62.75
  Bottom 0.2: v66.5,81 66.5,64.5 68.05,62.95 78.36,62.95 78.53,63.12 82.88,63.12 v83.25,62.75
ENT5-6  (via drill 0.35)
  Top 0.2: U$1.12/MISO 77.17,60.67 77.25,60.75 v77.5,60.75
  Bottom 0.2: R9.2 110.57,76.78 110.08,76.28 110.08,74.32 111.79,72.6 111.79,63.29 110,61.5 94.5,61.5 | 94.36,61.5 94.5,61.5 | 94.5,61.5 93.25,60.25 87.25,60.25 87,60 85.64,60 84.89,60.75 79.02,60.75 78.87,60.6 78.13,60.6 77.98,60.75 v77.5,60.75
ENT5A  (via drill 0.35)
  Top 0.2: U$1.10/CS 82.25,63.29 v81.39,64.14 | v81,82.5 82.15,81.35 IC3.2
  Bottom 0.2: v81,82.5 81.39,82.11 v81.39,64.14
ENT5B  (via drill 0.35)
  Top 0.2: v84.5,63.75 84.5,57.91 U$1.9/CS
  Bottom 0.2: v84.5,63.75 87.25,63.75 88,64.5 88,68 87.35,68.65 IC3.7
ENT6A  (via drill 0.35)
  Top 0.2: U$1.7 89.87,60.87 v90.5,61.5
  Bottom 0.2: IC3.10 93.65,68.65 92,67 92,63.5 90.5,62 v90.5,61.5
ENT6B  (via drill 0.35)
  Top 0.2: U$1.8 87.33,61.33 87.5,61.5 v87.75,61.5
  Bottom 0.2: IC3.15 93.35,81.35 92.5,80.5 92.5,79.47 92.24,79.21 92.24,67.88 91.5,67.14 91.5,64 89,61.5 v87.75,61.5
ENT7-8  (via drill 0.35)
  Top 0.2: v127,58 127,52.75 126.5,52.25 v126.62,52.12
  Bottom 0.2: R11.2 145.32,79.18 141.47,75.08 140.58,75.08 140.5,75 140.25,75 136.81,71.55 136.81,65.4 136.93,65.28 136.93,64.72 136.81,64.6 136.81,59.81 135,58 v127,58 126.75,58 | U$1.11/MOSI 84.08,53.25 123.16,53.25 123.66,52.75 125.05,52.75 125.47,52.33 126.42,52.33 v126.62,52.12 126.75,52
ENT7A  (via drill 0.35)
  Top 0.2: IC4.2 115.85,81.35 v115.5,81
  Bottom 0.2: v115.5,81 115.5,67.48 114.55,66.53 114.55,61.55 113.95,60.95 96.31,60.95 94.86,59.5 93,59.5 92.41,58.91 U$1.6
ENT7B
  Bottom 0.2: IC4.7 119.64,67.1 115.75,67.1 115,66.34 115,61 114.5,60.5 96.5,60.5 94.95,58.95 U$1.5
ENT8A
  Bottom 0.2: U$1.3/CANTX 101.91,59.5 126,59.5 127,60.5 127,68 127.65,68.65 IC4.10
ENT8B
  Bottom 0.2: U$1.4/CANRX 99.87,60 125,60 126.5,61.5 126.5,68.3 126.67,68.47 126.67,71.02 127.8,72.15 130.15,72.15 131.5,73.5 131.5,77.5 131.15,77.85 127.8,77.85 127.24,78.41 127.24,79.21 127.8,79.77 128.39,79.77 128.81,80.19 IC4.15
GND  (via drill 0.35)
  Bottom 1.016: U3.GND 87.44,15.49 | 87.44,15.49 C3.2 | 87.44,15.49 87.93,15 C2.2 89.05,13.95 89.75,13.25 93.02,13.25 C6.- | C13.- 27.86,20.64 28.5,20 28.5,18.78 C12.2 | C10.2 C11.2
  other vias: 18.25,79 18.25,76.25 18.25,73.75 34,76.25 41.25,76.25 38.75,76.25 36.25,76.25 18.25,71.25 18.25,68.75 20,68.75 20,71.25 20,73.75 20,76.25 20,79 54,79 55.75,79 54,76.25 55.75,76.25 54,73.75 55.75,73.75 55.75,71.25 54,71.25 54,68.75 55.75,68.75 68.75,76.25 71.25,76.25 73.75,76.25 76,76.25 89,79 91,79 89,76.25 89,73.75 89,71.25 89,68.75 91,68.75 91,71.25 91,73.75 91,76.25 104.5,76 106.5,76 108.75,76 110.75,76 123.75,78.75 126,78.75 123.75,76.25 126,76.25 124,73.75 126,73.75 124,71.25 126,71.25 124,68.75 126,68.75 139,76 141.25,76 144,76 146.25,76 99,28 99.25,22.25 100.5,33.25 97.25,47.75
  pour Top: 0.5,99.5 159.5,99.5 159.5,0.5 35.5,0.5 35.5,10.25 48,10.25 48,35.25 40.5,35.25 40.5,14.25 0.5,14.25
  pour Bottom: 0.5,99.5 159.5,99.5 159.5,0.5 48,0.5 48,39 0.5,39
INT  (via drill 0.35)
  Top 0.2: v133.5,40 133.5,43.5 132.08,44.92 JP3.10
  Bottom 0.2: U$1.16/A2 84.79,40.71 85.2,40.3 87.66,40.3 87.79,40.42 94.12,40.42 95.05,39.5 133,39.5 v133.5,40
KEY  (via drill 0.35)
  Top 0.2: JP3.7 126.96,47.46 126,46.5 v126,40.5
  Bottom 0.2: U$1.17/A3 87.33,41.67 88.12,40.88 94.31,40.88 95.18,40 125.5,40 v126,40.5
M1  (via drill 0.35)
  Top 0.2: U1.10 139.85,36.5 139.5,36.85 v139.5,37 | v77.5,39.5 77.17,39.83 U$1.13/SCK
  Bottom 0.2: v139.5,37 137.5,39 94.91,39 93.93,39.98 87.97,39.98 87.85,39.85 84.8,39.85 84.45,40 78,40 v77.5,39.5
M2  (via drill 0.35)
  Top 0.2: 137,25.41 U1.11 135.5,26.91 135.5,35.5 135.25,35.75 135.25,48.25 135,48.5 v134.75,48.5
  Bottom 0.2: U$1.32/A13 55.39,54 74,54 75.75,52.25 96.69,52.25 96.7,52.26 111.49,52.26 116.75,47 125.5,47 127.25,48.75 131.5,48.75 131.68,48.57 131.73,48.57 131.8,48.5 v134.75,48.5
M3  (via drill 0.35)
  Top 0.2: v133.75,51.25 134.75,50.25 134.75,49.45 134.07,48.78 134.07,48.22 134.75,47.55 134.75,35.25 135,35 135,34.25 134.77,34.02 U1.12
  Bottom 0.2: U$1.31/A12 55.93,56 63.87,56 64.03,56.15 64.92,56.15 65.07,56 72.75,56 76,52.75 122.11,52.75 122.31,52.55 123.22,52.55 124.52,51.25 v133.75,51.25
N$1  (via drill 0.35)
  Top 0.61: U$1.AREF 102.5,44.99 v102.5,47
  Bottom 0.406: L1.2 102.5,47.5 v102.5,47 103.05,47.55 C5.1
N$2
  Bottom 1.016: D7.C 44.57,30.3 44.27,30 | 44.27,30 OK1.2 | 44.27,30 41.5,30 41.2,29.7 C1.1 39.95,29.7 38.25,28 33.55,28 R1.1
N$3  (via drill 0.35)
  Top 0.61: OK1.8 61.84,32.41 66.06,28.19 76.25,28.19 v77,28.26
  Bottom 0.406: C10.1 C11.1
  Bottom 0.61: D1.C 76.75,27.75 77,28 v77,28.26
  Bottom 1.016: C10.1 52.5,33.15 OK1.8 | C11.1 R2.2
N$4
  Bottom 1.016: OK1.7 54.37,29.87 55,30.5 R2.1
N$5
  Bottom 0.61: Q2.B 75.04,82.4 R7.1
N$6
  Bottom 1.016: C6.+ 91.77,16.27 | C2.1 90.95,15.45 91.77,16.27 | 91.77,16.27 89.98,18.06 U3.OUT 89.98,22.02 81.01,22.02 D2.A | D1.A D2.A | D2.A
N$7
  Bottom 0.61: R5.1 40.57,85.43 40,86 40,88.31 Q1.B
N$8  (via drill 0.35)
  Top 1.016: v37.5,96.5 Q1.C
  Bottom 0.61: D3.C 38.25,84 37.5,84.75 Q1.C
  Bottom 1.016: X1.2 14.75,97.25 15.5,98 25.5,98 | v37.5,96.5 36,98 25.5,98 | X1.5 25.25,97.75 25.5,98
N$9
  Bottom 1.016: LED5.A 18.07,89.05 R19.1
N$12  (via drill 0.35)
  Top 1.016: v72.5,96.75 Q2.C
  Bottom 0.61: D4.C 73,85 72.5,85.5 Q2.C
  Bottom 1.016: X2.2 49.75,97.5 50.25,98 60.5,98 | 60.5,98 71.25,98 v72.5,96.75 | X2.5 60.25,97.75 60.5,98
N$13
  Bottom 1.016: R20.1 66.22,88.8 LED6.A
N$14
  Bottom 1.016: LED7.A 53.22,88.8 R21.1
N$15
  Bottom 1.016: R22.1 101.22,88.8 LED8.A
N$16
  Bottom 1.016: R23.1 88.47,88.55 LED9.A
N$17
  Bottom 0.406: LED10.A 136.47,88.55 R24.1
N$18
  Bottom 1.016: R25.1 123.72,88.55 LED11.A
N$19
  Bottom 1.016: LED12.A 26.45,89 R26.1
N$20
  Bottom 0.61: R9.1 110.57,85.43 110,86 110,88.31 Q3.B
N$22  (via drill 0.35)
  Top 1.016: v107.5,96.75 Q3.C
  Bottom 0.61: D6.C 108.25,85.25 107.5,86 Q3.C
  Bottom 1.016: X3.2 84.75,97.25 85.5,98 95,98 | 95,98 106.25,98 v107.5,96.75 | X3.5 95.25,97.75 95,98
N$23
  Bottom 1.016: LED13.A 13.45,89 R27.1
N$24
  Bottom 1.016: LED14.A 59.72,88.8 R28.1
N$25
  Bottom 1.016: LED15.A 46.72,88.8 R29.1
N$26
  Bottom 1.016: R30.1 94.97,88.55 LED16.A
N$27
  Bottom 0.61: R11.1 145.32,85.68 145,86 145,88.31 Q4.B
N$29
  Bottom 0.61: D5.C 143,85.5 142.5,86 Q4.C
  Bottom 1.016: 130.25,98 120.5,98 119.75,97.25 X4.2 | 130.25,98 141.25,98 142.5,96.75 Q4.C | X4.5 130.25,98
N$30
  Bottom 1.016: R31.1 81.97,88.55 LED17.A
N$31
  Bottom 0.406: LED18.A 129.97,88.55 R32.1
N$32
  Bottom 1.016: R33.1 117.22,88.55 LED19.A
N$34
  Bottom 1.016: D8.A JP1.1
N$35
  Bottom 2.54: X9.3 17.48,5.77 11.75,11.5 11.75,18.75 12.75,19.75 14.5,19.75 B1.AC1
N$36
  Bottom 2.54: X9.4 8.5,8.88 8.5,22.25 11.75,25.5 15.22,25.5 B1.AC2
N$37
  Top 1.27: B2.+ 38.25,16.75 79.75,16.75 | C8.+ 79.75,16.75 | U3.IN 82.69,17.69 81.75,16.75 79.75,16.75
  Bottom 1.016: U3.IN 84.9,15.15 C3.1 | JP1.2 31,29.94 31,16.75 32.25,15.5 B2.+
N$38
  Top 1.27: IC5.10 51.75,11.27 X11.4
  Bottom 1.016: X10.2 88.75,3.25 88,2.5 81.75,2.5 | 81.75,2.5 74.5,2.5 | 74.5,2.5 58.75,2.5 | 58.75,2.5 51.75,2.5 | 51.75,2.5 44.75,2.5 | 44.75,2.5 34.41,2.5 F1.2 | X11.6 44.75,2.5 | X11.4 51.75,2.5 | X11.2 58.75,2.5 | X10.6 74.75,2.75 74.5,2.5 | X10.4 81.75,2.5
N$42
  Bottom 0.61: R15.1 LED3.A
N$43
  Bottom 0.61: R13.1 LED1.A
N$44
  Bottom 0.61: R14.1 LED2.A
N$45
  Bottom 1.27: C21.+ 151.29,18.5 150.5,18.5 150.45,18.45 D12.C 144.05,18.45 144,18.5 142.39,16.89 U1.8
N$46
  Bottom 1.27: X5.1 146.85,4.85 148.5,6.5 148.5,10 148,10.5 148,10.8 D12.A
N$47
  Bottom 1.016: LED4.A 32.95,89 R18.1
O1
  Bottom 0.61: X11.7 41.25,7 42.25,8 52.75,8 55.88,11.13 IC5.11
O2
  Bottom 0.61: X11.5 48.25,6 49.25,7 53.85,7 55.91,9.06 56.81,9.06 58.42,10.67 IC5.12
O3
  Bottom 0.61: X11.3 55.5,5.35 55.5,6.5 57.25,8.25 59.75,8.25 60.96,9.46 IC5.13
O4
  Bottom 0.61: X11.1 62.25,6.75 63.5,8 IC5.14
O5
  Bottom 0.61: X10.7 71.25,6.5 70.75,7 67.5,7 66.38,8.12 66.19,8.31 66.04,8.46 IC5.15
O6
  Bottom 0.61: X10.5 78.25,7 77.25,8 69.25,8 68.58,8.67 IC5.16
O7
  Bottom 0.61: X10.3 85.25,7.25 83.5,9 72.5,9 71.12,10.38 IC5.17
O8
  Bottom 0.61: X10.1 92.25,8.25 90.5,10 74.75,10 73.66,11.09 IC5.18
OC1-2  (via drill 0.35)
  Top 0.2: v31.5,44.5 32,45 32,61 v32.5,61.5
  Bottom 0.2: 34,84.25 34.55,84.25 R4.2 32.5,81.3 v32.5,61.5 | U$1.33/A14 33.62,42.38 v31.5,44.5
  Bottom 1.016: Q1.E 34.96,85.21 34,84.25
OC3-4  (via drill 0.35)
  Top 0.2: U$1.34/A15 56,44.07 56,56.95 55.78,57.17 55.78,58.06 56,58.29 56,61.5 56.25,61.5 v56.5,61.75
  Bottom 0.2: R6.2 68.8,85 65.5,85 64.5,84 64.5,70.5 64,70 57.5,70 57,69.5 57,68 56,67 56,62 56.25,61.75 v56.5,61.75
  Bottom 1.016: Q2.E 69.96,83.84 R6.2
OC5-6  (via drill 0.35)
  Top 0.2: v91,47.5 91,60 v92.38,61.38
  Bottom 0.2: R8.2 100.55,79.6 100.55,72.07 100.5,72.02 100.5,64 99,62.5 93.5,62.5 v92.38,61.38 92,61 | U$1.35/A16 60.46,45.99 64.92,45.99 65.66,45.25 88.5,45.25 90.75,47.5 v91,47.5
  Bottom 1.016: Q3.E 104.96,84.09 R8.2
OC7-8  (via drill 0.35)
  Top 0.2: 139.96,85.52 Q4.E | v138.75,47 138.75,53.5 136.25,56 v136.25,65
  Bottom 0.2: R10.2 136.25,80.05 v136.25,65 | U$1.36/A17 60.77,41 80.5,41 81,41.5 81,44 81.8,44.8 88.69,44.8 89.39,45.5 94.5,45.5 96.25,43.75 114.25,43.75 116.5,46 128.24,46 128.27,46.03 133.53,46.03 134,46.5 136.22,46.5 136.36,46.64 138.39,46.64 v138.75,47
  Bottom 1.016: Q4.E 139.96,83.84 R10.2
OT1A
  Top 1.016: X1.3 18.25,93.25 17.5,92.5 16,92.5 15.48,91.98 LED5.K
  Bottom 1.016: IC1.3 13.69,78.81 12,80.5 12,85 13.5,86.5 14.5,86.5 15.5,87.5 15.48,87.52 LED5.K
OT1B
  Top 1.016: X1.1 10.4,94.9 9,93.5 9,89.02 LED13.K
  Bottom 1.016: IC1.6 11.31,71.19 9,73.5 9,88.98 LED13.K
OT2A
  Top 1.016: LED4.K 28.48,94.63 X1.6
  Bottom 1.016: LED4.K 28.48,87.98 27,86.5 27,73.5 24.69,71.19 IC1.11
OT2B
  Top 1.016: LED12.K 21.98,94.67 X1.4
  Bottom 1.016: IC1.14 24.31,78.81 25.5,80 25.5,86 24.5,87 22.5,87 21.98,87.52 LED12.K
OT3A
  Top 1.016: X2.3 50.48,92.13 LED7.K
  Bottom 1.016: IC2.3 49.19,78.81 48.25,79.75 48.25,84.25 50.5,86.5 50.5,88.98 LED7.K
OT3B
  Top 1.016: X2.1 43.98,92.63 LED15.K
  Bottom 1.016: IC2.6 48.06,71.19 46.75,72.5 46.75,84.25 43.98,87.02 LED15.K
OT4A
  Top 1.016: X2.6 63.48,94.63 LED6.K
  Bottom 1.016: IC2.11 61.19,71.19 63,73 63,86 63.5,86.5 63.5,88.98 LED6.K
OT4B
  Top 1.016: X2.4 56.75,89.23 LED14.K
  Bottom 1.016: IC2.14 60.81,78.81 61.5,79.5 61.5,85.25 60.75,86 57.75,86 57,86.75 57,88.98 LED14.K
OT5A
  Top 1.016: X3.3 88.25,93.75 85.5,91 85.5,89.02 LED9.K
  Bottom 1.016: IC3.3 84.19,78.81 83.75,79.25 83.75,84.75 85.5,86.5 85.5,88.98 LED9.K
OT5B
  Top 1.016: LED17.K 78.98,92.63 X3.1
  Bottom 1.016: 79,88.98 LED17.K 78.98,87.02 82.25,83.75 82.25,72.5 83.56,71.19 IC3.6
OT6A
  Top 1.016: X3.6 98.75,89.27 LED8.K
  Bottom 1.016: LED8.K 98.48,73.98 95.69,71.19 IC3.11
OT6B
  Top 1.016: X3.4 91.75,89.23 LED16.K
  Bottom 1.016: LED16.K 91.98,86.77 93,85.75 95.75,85.75 97,84.5 97,80.25 95.56,78.81 IC3.14
OT7A
  Top 1.016: X4.3 123.25,92.75 120.48,90.23 LED11.K
  Bottom 1.016: IC4.3 119.44,78.81 119,79.25 119,85 120.5,86.5 120.5,88.98 LED11.K
OT7B
  Top 1.016: X4.1 113.98,92.63 LED19.K
  Bottom 1.016: LED19.K 113.98,87.27 117.25,84 117.25,73 119.06,71.19 IC4.6
OT8A
  Top 1.016: X4.6 133.73,94.88 LED10.K
  Bottom 1.016: LED10.K 133.48,73.48 131.19,71.19 IC4.11
OT8B
  Top 1.016: LED18.K 126.98,92.27 126.75,92.5 X4.4
  Bottom 1.016: IC4.14 130.56,78.81 131,79.25 131,85 130.5,86 127.5,86 127,86.5 127,88.98 LED18.K
RED  (via drill 0.35)
  Top 0.2: LED1.K 115.5,14.09 114.31,15.28 114.31,36.69 v114.5,37 | U$1.38/A19 64.47,39.03 65,38.5 v66,38.5
  Bottom 0.2: v114.5,37 114,37.5 94.5,37.5 93.38,38.62 88.53,38.62 88.41,38.5 85.06,38.5 84.79,38.39 84.53,38.5 78.73,38.5 78.15,37.92 76.85,37.92 76.27,38.5 68.59,38.5 67.97,37.88 67.03,37.88 66.41,38.5 v66,38.5
RX
  Bottom 0.2: JP3.1 128.65,55 127.5,55 126,56.5 123.09,56.5 122.76,56.83 122.26,56.83 121.72,57.38 120.78,57.38 120.24,56.83 110.92,56.83 110.64,56.55 109.75,56.55 109.46,56.83 108.44,56.83 U$1.0/RX
SCL  (via drill 0.35)
  Top 0.2: J1.1 114.5,12.55 113.86,13.19 113.86,35.64 v113.5,36 | U$1.18/A4/SDA 89.87,38.87 89,38 v89,37.5 | v138,37 138,53 135.92,55.08 JP3.2
  Bottom 0.2: U2.1 70,34.62 70.5,35.12 70.5,36.5 71.05,37.05 76.45,37.05 76.47,37.02 88.16,37.02 88.64,37.5 v89,37.5 89.07,37.43 91.93,37.43 93.36,36 v113.5,36 114,35.5 134.5,35.5 135.04,36 135.72,36.67 137.68,36.67 v138,37
  Bottom 1.016: J1.1 R16.1
SDA  (via drill 0.35)
  Top 0.2: J1.2 116.5,9 118.67,11.18 118.67,20.23 118.5,20.41 v118.5,34.5 | v91.19,36.55 91.14,36.5 91,36.5 91.5,37 91.5,41.47 U$1.19/A5/SCL | JP3.6 133.5,50 134.08,49.42 133.62,48.97 133.62,48.03 134.25,47.41 v134.25,34.5
  Bottom 0.2: v134.25,34.5 134,34.5 v118.5,34.5 118,35 92.74,35 v91.19,36.55 71.55,36.55 71,36 71,34.21 70.13,33.34 U2.2
  Bottom 1.016: J1.2 116.5,5.75 117,6.25 R17.1
STEP  (via drill 0.35)
  Top 0.2: U1.15 127.15,38 125.06,40.09 125.06,52.31 v125.75,53
  Bottom 0.2: U$1.26 68.39,59 74.82,59 74.85,58.98 77.95,58.98 78.18,59.2 80.5,59.2 81,58.7 81,56.97 82.97,55 92.72,55 93.23,55.52 104.28,55.52 104.78,55.03 108.72,55.03 109,54.75 111.38,54.75 111.66,55.03 120.47,55.03 121.8,53.7 123.34,53.7 123.84,53.2 125.55,53.2 v125.75,53
TRACK1
  Top 1.016: X9.1 27.64,6.39 33,11.75 33,23.5 35.03,25.53 B2.AC2
  Bottom 1.016: B2.AC2 33.02,25.53 R1.2
TRACK2
  Top 1.016: X9.2 26.01,1.52 32,1.52 34.5,4.02 34.5,19.5 35.5,20.5 B2.AC1
  Bottom 1.016: D7.A 44.77,26.7 OK1.3 44.06,27.25 41.75,27.25 41.2,27.8 C1.2 40.75,21.5 39.75,20.5 B2.AC1
TX
  Bottom 0.2: JP3.3 128.04,52.54 128,52.5 127,53.5 127,54 125.5,55.5 123.45,55.5 122.58,56.38 122.08,56.38 121.53,56.92 120.97,56.92 120.42,56.38 111.1,56.38 110.82,56.1 109.56,56.1 109.28,56.38 106.35,56.38 U$1.1/TX

### Text on the board
tPlace: O1 | O2 | O3 | O4 | O5 | O6 | O7 | O8
tNames: DCC Accessory Board / Rev 1.0 / April 2018 | Fault | Power Ok | Status | 0V | 1B | 1A | 2A | 2B | VMOT